# EAGLE design 20240511-sn76489-kempton-ver1 (EAGLE 9.6.2)
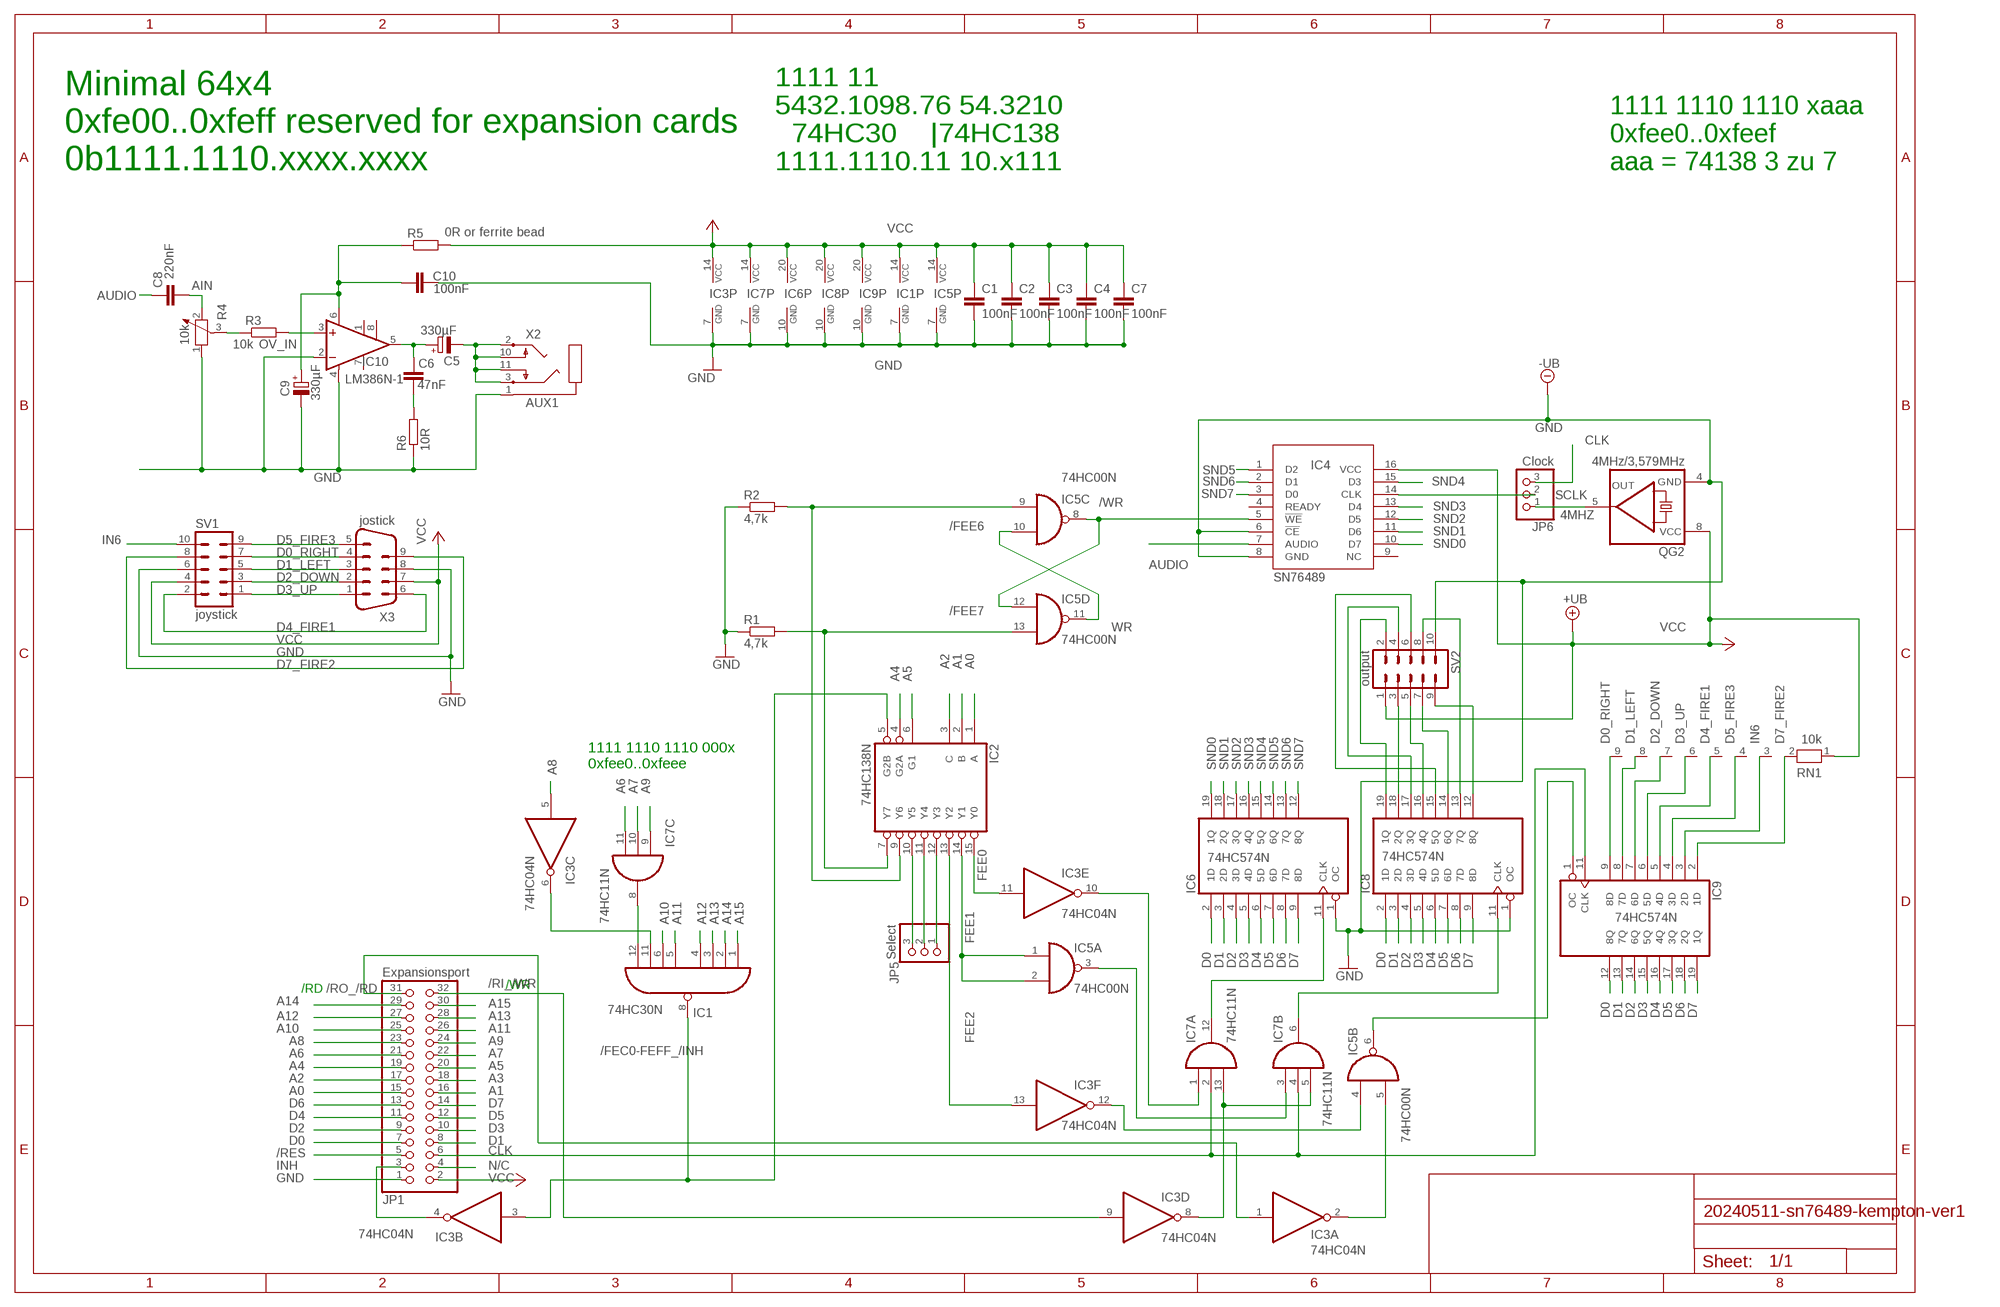
[diagram p0: schematic, sheet 1]

## Parts
C1  100nF  C-EU050-025X075  [C050-025X075]
C2  100nF  C-EU050-025X075  [C050-025X075]
C3  100nF  C-EU050-025X075  [C050-025X075]
C4  100nF  C-EU050-025X075  [C050-025X075]
C5  330µF  CPOL-EUE2.5-7  [E2,5-7]
C6  47nF  C-EU050-025X075  [C050-025X075]
C7  100nF  C-EU050-025X075  [C050-025X075]
C8  220nF  C-EU050-025X075  [C050-025X075]
C9  330µF  CPOL-EUE2.5-7  [E2,5-7]
C10  100nF  C-EU050-025X075  [C050-025X075]
IC1  74HC30N  [DIL14]
IC2  74HC138N  [DIL16]
IC3  74HC04N  [DIL14]
IC4  SN76489  ALEX-PARTS_SN76489AN  [ALEX-PARTS_DIL16]
IC5  74HC00N  [DIL14]
IC6  74HC574N  [DIL20]
IC7  74HC11N  [DIL14]
IC8  74HC574N  [DIL20]
IC9  74HC574N  [DIL20]
IC10  LM386N-1  [DIL08]
JP1  Expansionsport  PINHD-2X16  [2X16]
JP5  Select  PINHD-1X3  [1X03]
JP6  Clock  PINHD-1X3  [1X03]
QG2  4MHz/3,579MHz  QG5460  [DIL08S]
R1  4,7k  R-EU_0207/10  [0207/10]
R2  4,7k  R-EU_0207/10  [0207/10]
R3  10k  R-EU_0207/10  [0207/10]
R4  10k  POTENTIOMETER_PT-10S  [PT-10S]
R5  0R or ferrite bead  R-EU_0207/10  [0207/10]
R6  10R  R-EU_0207/10  [0207/10]
RN1  10k  RN08  [RN-9]
SV1  joystick  ML10  [ML10]
SV2  output  ML10  [ML10]
X2  AUX1  CON-SJ1-352XNSJ1-352XN  [SJ1-352XN]
X3  jostick  M09-182  [182-009-MALE]

## Nets
4MHZ: JP6.1 QG2.5(OUT)
/FEC0-FEFF_/INH: IC1.8(O) IC2.5(G2B) IC3.3(B:I)
/FEE6: IC2.9(Y6) IC5.9(C:I0) R2.2
/FEE7: IC2.7(Y7) IC5.13(D:I1) R1.2
/RES: JP1.5
/RI_/WR: IC3.9(D:I) JP1.32
/RO_/RD: IC3.1(A:I) JP1.31
/WR: IC4.5(!WE) IC5.8(C:O) IC5.12(D:I0)
A0: IC2.1(A) JP1.15
A1: IC2.2(B) JP1.16
A2: IC2.3(C) JP1.17
A3: JP1.18
A4: IC2.4(G2A) JP1.19
A5: IC2.6(G1) JP1.20
A6: IC7.11(C:I2) JP1.21
A7: IC7.10(C:I1) JP1.22
A8: IC3.5(C:I) JP1.23
A9: IC7.9(C:I0) JP1.24
A10: IC1.6(I5) JP1.25
A11: IC1.5(I4) JP1.26
A12: IC1.4(I3) JP1.27
A13: IC1.3(I2) JP1.28
A14: IC1.2(I1) JP1.29
A15: IC1.1(I0) JP1.30
AIN: C8.2 R4.2
AUDIO: C8.1 IC4.7(AUDIO)
AUXOUT1: C5.- X2.2 X2.3 X2.10 X2.11
AVCC [Power]: C9.+ C10.1 IC10.6(VS) R5.1
CLK: IC7.2(A:I1) IC7.4(B:I1) IC9.11(CLK) JP1.6 JP6.3
D0: IC6.2(1D) IC8.2(1D) IC9.12(8Q) JP1.7
D0_RIGHT: IC9.9(8D) RN1.9 SV1.7 X3.4
D1: IC6.3(2D) IC8.3(2D) IC9.13(7Q) JP1.8
D1_LEFT: IC9.8(7D) RN1.8 SV1.5 X3.3
D2: IC6.4(3D) IC8.4(3D) IC9.14(6Q) JP1.9
D2_DOWN: IC9.7(6D) RN1.7 SV1.3 X3.2
D3: IC6.5(4D) IC8.5(4D) IC9.15(5Q) JP1.10
D3_UP: IC9.6(5D) RN1.6 SV1.1 X3.1
D4: IC6.6(5D) IC8.6(5D) IC9.16(4Q) JP1.11
D4_FIRE1: IC9.5(4D) RN1.5 SV1.2 X3.6
D5: IC6.7(6D) IC8.7(6D) IC9.17(3Q) JP1.12
D5_FIRE3: IC9.4(3D) RN1.4 SV1.9 X3.5
D6: IC6.8(7D) IC8.8(7D) IC9.18(2Q) JP1.13
D7: IC6.9(8D) IC8.9(8D) IC9.19(1Q) JP1.14
D7_FIRE2: IC9.2(1D) RN1.2 SV1.8 X3.9
FEE0: IC2.15(Y0) IC3.11(E:I)
FEE1: IC2.14(Y1) IC5.1(A:I0) IC5.2(A:I1)
FEE2: IC3.12(F:O) IC5.4(B:I0)
FEE3: IC2.12(Y3) JP5.1
FEE4: IC2.11(Y4) JP5.2
FEE5: IC2.10(Y5) JP5.3
GND [Power]: C1.2 C2.2 C3.2 C4.2 C7.2 C9.- C10.2 IC1.7(GND) IC3.7(P:GND) IC4.6(!CE) IC4.8(GND) IC5.7(P:GND) IC6.1(OC) IC6.10(GND) IC7.7(P:GND) IC8.1(OC) IC8.10(GND) IC9.10(GND) IC10.2(-IN) IC10.4(GND) JP1.1 QG2.4(GND) R1.1 R2.1 R4.1 R6.1 SV1.6 SV2.10 X2.1 X3.8 ; supply symbol labelled -UB
IN6: IC9.3(2D) RN1.3 SV1.10
INH: IC3.4(B:O) JP1.3
INPUT_EN: IC5.6(B:O) IC9.1(OC)
N$1: IC3.2(A:O) IC5.5(B:I1)
N$2: IC3.10(E:O) IC7.1(A:I0)
N$3: IC1.12(I7) IC7.8(C:O)
N$4: IC5.3(A:O) IC7.3(B:I0)
N$5: IC2.13(Y2) IC3.13(F:I)
N$6: C6.2 R6.2
N$8: R3.1 R4.3
N$19: IC1.11(I6) IC3.6(C:O)
N/C: JP1.4
OUT0: IC8.19(1Q) SV2.2
OUT1: IC8.18(2Q) SV2.3
OUT2: IC8.17(3Q) SV2.4
OUT3: IC8.16(4Q) SV2.5
OUT4: IC8.15(5Q) SV2.6
OUT5: IC8.14(6Q) SV2.7
OUT6: IC8.13(7Q) SV2.8
OUT7: IC8.12(8Q) SV2.9
OUTPUT_EN: IC7.6(B:O) IC8.11(CLK)
OV_IN: IC10.3(+IN) R3.2
R2C2C3: C5.+ C6.1 IC10.5(OUT)
RI_WR: IC3.8(D:O) IC7.5(B:I2) IC7.13(A:I2)
SCLK: IC4.14(CLK) JP6.2
SND0: IC4.10(D7) IC6.19(1Q)
SND1: IC4.11(D6) IC6.18(2Q)
SND2: IC4.12(D5) IC6.17(3Q)
SND3: IC4.13(D4) IC6.16(4Q)
SND4: IC4.15(D3) IC6.15(5Q)
SND5: IC4.1(D2) IC6.14(6Q)
SND6: IC4.2(D1) IC6.13(7Q)
SND7: IC4.3(D0) IC6.12(8Q)
SOUND_EN: IC6.11(CLK) IC7.12(A:O)
VCC [Power]: C1.1 C2.1 C3.1 C4.1 C7.1 IC1.14(VCC) IC3.14(P:VCC) IC4.16(VCC) IC5.14(P:VCC) IC6.20(VCC) IC7.14(P:VCC) IC8.20(VCC) IC9.20(VCC) JP1.2 QG2.8(VCC) R5.2 RN1.1 SV1.4 SV2.1 X3.7 ; supply symbol labelled +UB
WR: IC5.10(C:I1) IC5.11(D:O)
Unconnected: IC4.4(READY) IC4.9(NC) IC10.1(GAIN) IC10.7(BYPASS) IC10.8(GAIN)

## Notes on the sheet
- Minimal 64x4
  0xfe00..0xfeff reserved for expansion cards
  0b1111.1110.xxxx.xxxx
- 1111 11
  5432.1098.76 54.3210
    74HC30    |74HC138
  1111.1110.11 10.x111
- 1111 1110 1110 xaaa
  0xfee0..0xfeef
  aaa = 74138 3 zu 7
- 1111 1110 1110 000x
  0xfee0..0xfeee
- /WR
- /RD

## Power pins joined to a net without a drawn wire
GND: IC2.8(GND)
VCC: IC2.16(VCC)

## Library data of the parts
C1-C4 C6-C8 C10 = rcl:C-EU: CAPACITOR, European symbol; SPICEPREFIX: C
C5 C9 = rcl:CPOL-EU: POLARIZED CAPACITOR, European symbol; SPICEPREFIX: C
IC1 = 74xx-eu:74*30: 8-input NAND gate
IC2 = 74xx-eu:74*138: 3-line to 8-line DECODER/DEMULTIPLEXER
IC3 = 74xx-eu:74*04: Hex INVERTER
IC4 = squareinator2:ALEX-PARTS_SN76489AN: TI SN76489AN Sound Generator
IC5 = 74xx-eu:74*00: Quad 2-input NAND gate
IC6 IC8 IC9 = 74xx-eu:74*574: 8-bit D type FLIP FLOP bus driver
IC7 = 74xx-eu:74*11: Triple 3-input AND gate
IC10 = linear:LM386?-*: Low Voltage Audio Power Amplifier Source: http://cache.national.com/ds/LM/LM386.pdf
JP1 = pinhead:PINHD-2X16: PIN HEADER
JP5 JP6 = pinhead:PINHD-1X3: PIN HEADER
QG2 = crystal:QG5460: CRYSTAL RESONATOR; OC_FARNELL: unknown; OC_NEWARK: unknown
R1-R3 R5 R6 = rcl:R-EU_: RESISTOR, European symbol; SPICEPREFIX: R
R4 = rcl:POTENTIOMETER_: Potentiometer; SPICEMODEL: POT; SPICEPREFIX: X
RN1 = resistor-net:RN08: RESISTOR NETWORK; OC_FARNELL: unknown; OC_NEWARK: unknown
SV1 SV2 = con-harting-ml:ML10: HARTING; OC_FARNELL: unknown; OC_NEWARK: unknown
X2 = con-sj1-352xn:CON-SJ1-352XN: MIC/HEADPHONE JACK KS-S stereo microphone/headphone jack SJ1-352XN (CUD Devices)
X3 = con-subd:M09: SUB-D; OC_FARNELL: unknown; OC_NEWARK: unknown

## Net classes
1 Power: width 0.305 mm, clearance 0.152 mm

## Board
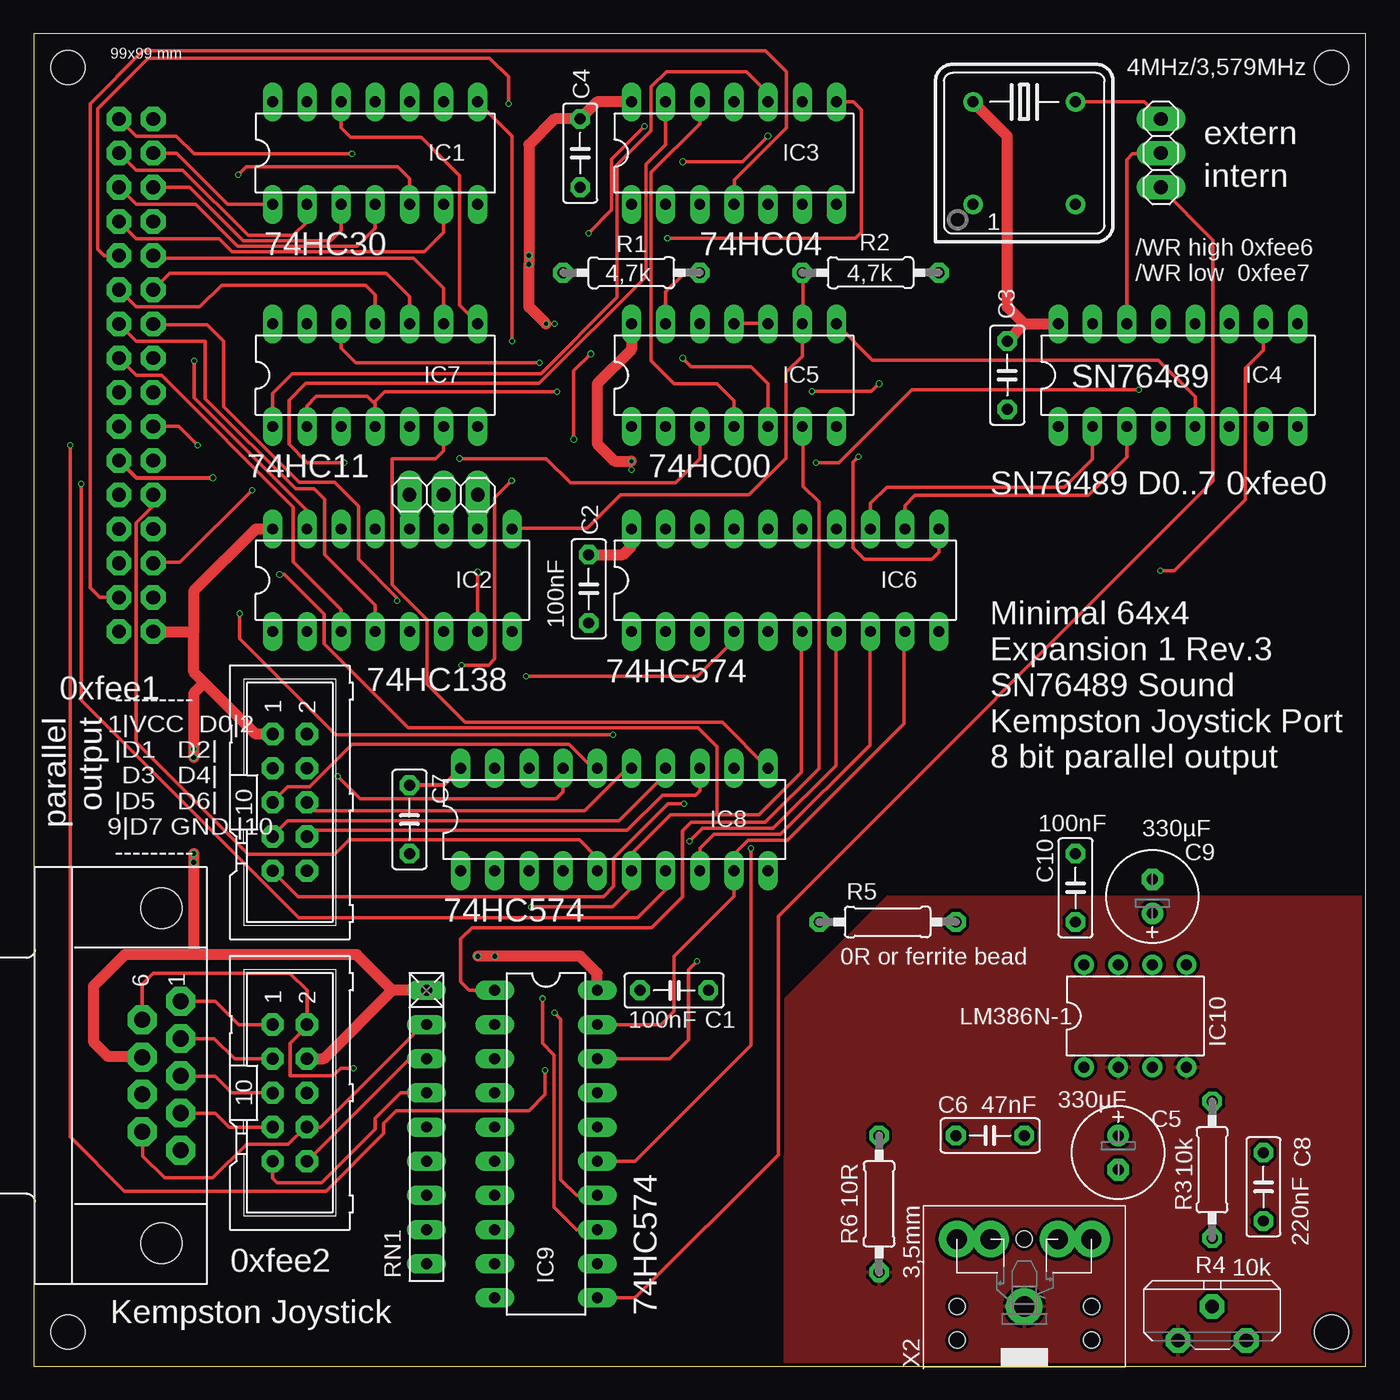
[diagram p1: board, top side]
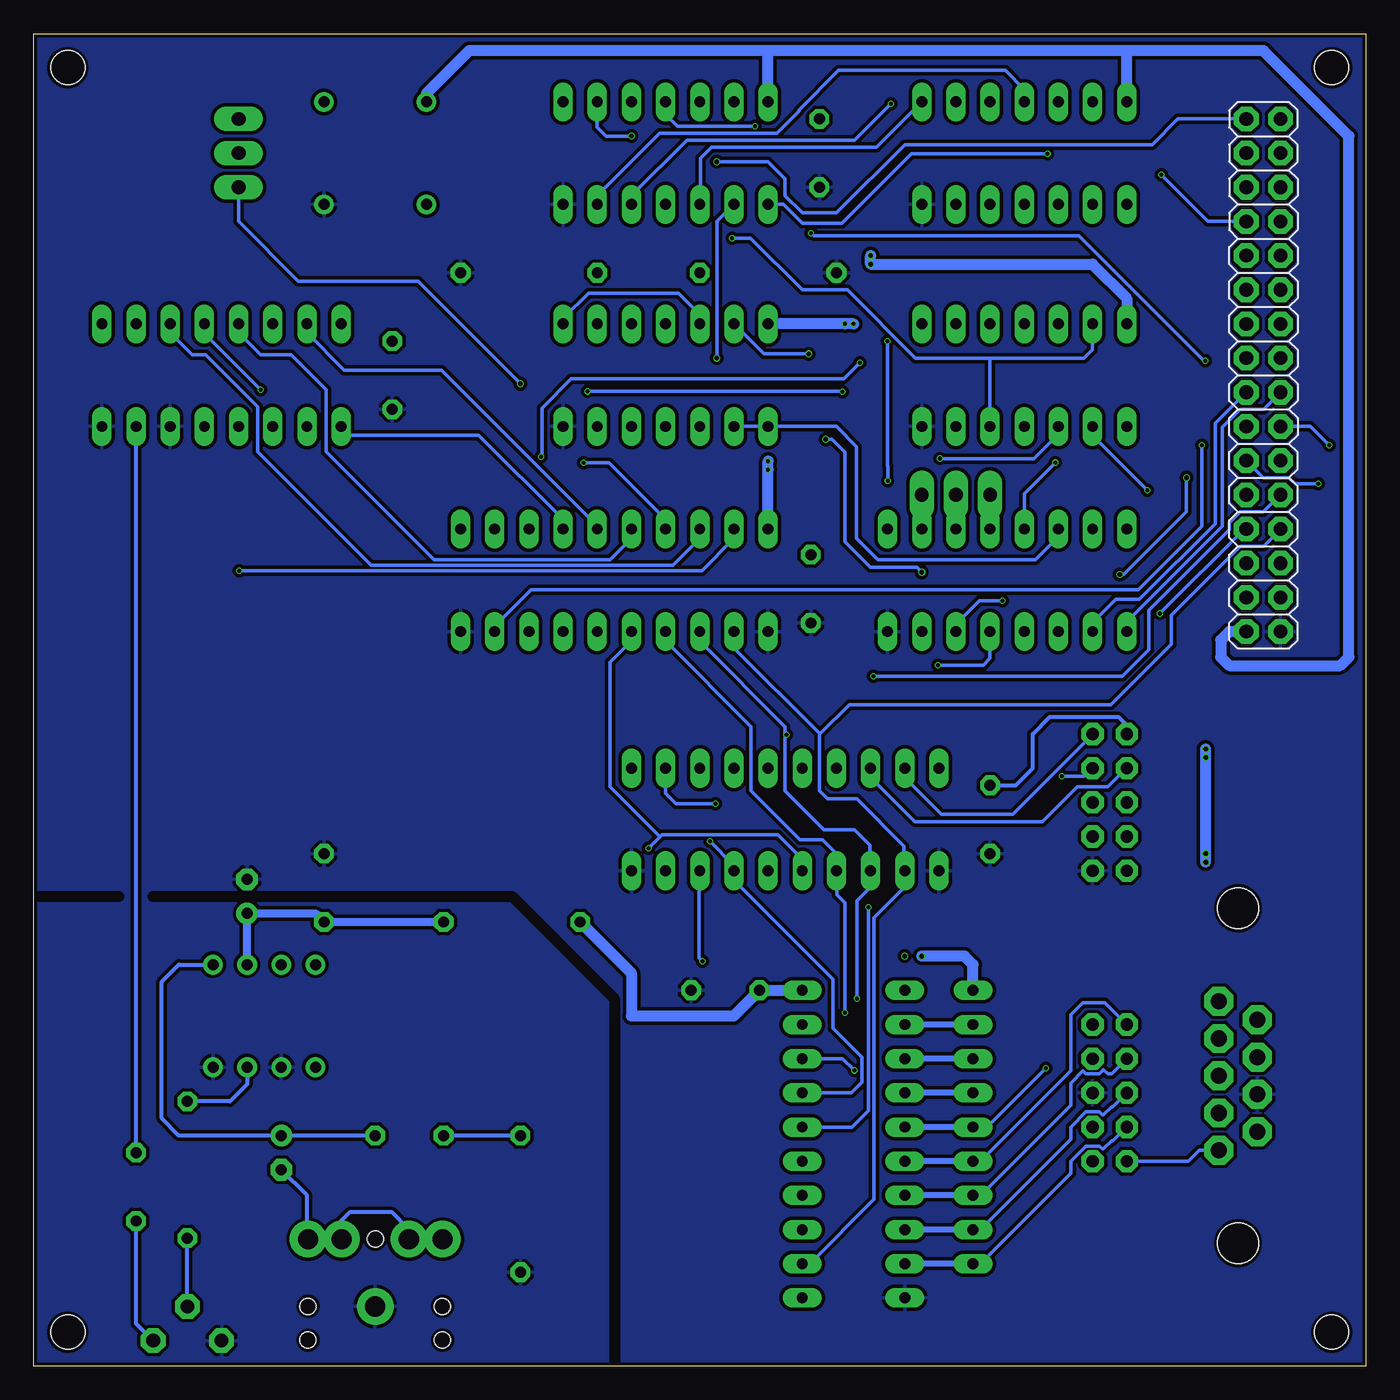
[diagram p2: board, bottom side, seen from below]

Size 99.06 x 99.05 mm. Coordinates in mm from the lower left corner, seen from the top.
Outline: 0,0 99.06,0 99.05,99.05 0,99.05 0,0
Copper layers (1*16): Top 0.035mm / dielectric 1.6mm / Bottom 0.035mm
Design rules "jlcpcb-2layers *": minimum track width 10mil, minimum drill 0.3mm, track to track 6mil, track to pad 6mil, pad to pad 6mil, via to via 6mil, smd to smd 6mil, copper to edge 0.2mm, drill to drill 6mil, minimum pad ring 10mil, minimum via ring 3mil, stop-mask expansion 4mil, vias tented up to drill 0mil, thermal gap 10mil
Holes 2.54 mm at 2.54,2.54 96.52,2.54 96.52,96.52 2.54,96.52
bRestrict: 4 lines

### Footprints (pad centres in the part's own frame; a part is rotated, then mirrored left to right if it is on the bottom)
C050-025X075 = drill 0.813 octagon: 1 -2.54,0; 2 2.54,0
E2,5-7 = drill 0.813 pad 1.6: + -1.27,0 | drill 0.813 pad 1.6 octagon: - 1.27,0
DIL14 = drill 0.813 long: 1 -7.62,-3.81; 2 -5.08,-3.81; 3 -2.54,-3.81; 4 0,-3.81; 5 2.54,-3.81; 6 5.08,-3.81; 7 7.62,-3.81; 8 7.62,3.81; 9 5.08,3.81; 10 2.54,3.81; 11 0,3.81; 12 -2.54,3.81; 13 -5.08,3.81; 14 -7.62,3.81
DIL16 = drill 0.813 long: 1 -8.89,-3.81; 2 -6.35,-3.81; 3 -3.81,-3.81; 4 -1.27,-3.81; 5 1.27,-3.81; 6 3.81,-3.81; 7 6.35,-3.81; 8 8.89,-3.81; 9 8.89,3.81; 10 6.35,3.81; 11 3.81,3.81; 12 1.27,3.81; 13 -1.27,3.81; 14 -3.81,3.81; 15 -6.35,3.81; 16 -8.89,3.81
ALEX-PARTS_DIL16 = drill 0.813 long: 1 -8.89,-3.81; 2 -6.35,-3.81; 3 -3.81,-3.81; 4 -1.27,-3.81; 5 1.27,-3.81; 6 3.81,-3.81; 7 6.35,-3.81; 8 8.89,-3.81; 9 8.89,3.81; 10 6.35,3.81; 11 3.81,3.81; 12 1.27,3.81; 13 -1.27,3.81; 14 -3.81,3.81; 15 -6.35,3.81; 16 -8.89,3.81
DIL20 = drill 0.813 long: 1 -11.43,-3.81; 2 -8.89,-3.81; 3 -6.35,-3.81; 4 -3.81,-3.81; 5 -1.27,-3.81; 6 1.27,-3.81; 7 3.81,-3.81; 8 6.35,-3.81; 9 8.89,-3.81; 10 11.43,-3.81; 11 11.43,3.81; 12 8.89,3.81; 13 6.35,3.81; 14 3.81,3.81; 15 1.27,3.81; 16 -1.27,3.81; 17 -3.81,3.81; 18 -6.35,3.81; 19 -8.89,3.81; 20 -11.43,3.81
DIL08 = drill 0.813 pad 1.27: 1 -3.81,-3.81; 2 -1.27,-3.81; 3 1.27,-3.81; 4 3.81,-3.81; 5 3.81,3.81; 6 1.27,3.81; 7 -1.27,3.81; 8 -3.81,3.81
2X16 = drill 1.016 octagon: 1 -19.05,-1.27; 2 -19.05,1.27; 3 -16.51,-1.27; 4 -16.51,1.27; 5 -13.97,-1.27; 6 -13.97,1.27; 7 -11.43,-1.27; 8 -11.43,1.27; 9 -8.89,-1.27; 10 -8.89,1.27; 11 -6.35,-1.27; 12 -6.35,1.27; 13 -3.81,-1.27; 14 -3.81,1.27; 15 -1.27,-1.27; 16 -1.27,1.27; 17 1.27,-1.27; 18 1.27,1.27; 19 3.81,-1.27; 20 3.81,1.27; 21 6.35,-1.27; 22 6.35,1.27; 23 8.89,-1.27; 24 8.89,1.27; 25 11.43,-1.27; 26 11.43,1.27; 27 13.97,-1.27; 28 13.97,1.27; 29 16.51,-1.27; 30 16.51,1.27; 31 19.05,-1.27; 32 19.05,1.27
1X03 = drill 1.016 long: 1 -2.54,0; 2 0,0; 3 2.54,0
DIL08S = drill 0.813: 1 -3.81,-3.81; 4 3.81,-3.81; 5 3.81,3.81; 8 -3.81,3.81
0207/10 = drill 0.813 octagon: 1 -5.08,0; 2 5.08,0
PT-10S = drill 1.016 pad 1.778 octagon: 1 -2.54,-1.27; 2 2.54,-1.27; 3 0,1.27
RN-9 = drill 0.813 long: 1 -10.16,0; 2 -7.62,0; 3 -5.08,0; 4 -2.54,0; 5 0,0; 6 2.54,0; 7 5.08,0; 8 7.62,0; 9 10.16,0
ML10 = drill 0.914 octagon: 1 -5.08,-1.27; 2 -5.08,1.27; 3 -2.54,-1.27; 4 -2.54,1.27; 5 0,-1.27; 6 0,1.27; 7 2.54,-1.27; 8 2.54,1.27; 9 5.08,-1.27; 10 5.08,1.27
SJ1-352XN = drill 1.5 pad 2.184: 1 0,0; 2 5,-5; 3 5,5; 10 5,-2.5; 11 5,2.5 | hole 1.2: 5,0; 0,5; 0,-5; -2.5,-5; -2.5,5
182-009-MALE = drill 1.194 pad 1.524 octagon: 1 -5.537,10.923; 2 -2.769,10.923; 3 0,10.923; 4 2.769,10.923; 5 5.537,10.923; 6 -4.153,8.08; 7 -1.384,8.08; 8 1.384,8.08; 9 4.153,8.08 | hole 3.048: -12.446,9.501; 12.446,9.501

### Placement (x,y rotation side)
C1  47.62,27.94 0 top
C2  41.27,57.78 270 top
C3  72.39,73.66 270 top
C4  40.64,90.17 270 top
C5  80.64,15.88 270 top
C6  71.12,17.14 180 top
C7  27.94,40.64 270 top
C8  91.44,13.34 270 top
C9  83.19,34.92 90 top
C10  77.47,35.56 90 top
IC1  25.4,90.17 0 top
IC2  26.67,58.42 0 top
IC3  52.07,90.17 0 top
IC4  85.09,73.66 0 top
IC5  52.07,73.66 0 top
IC6  55.88,58.42 0 top
IC7  25.4,73.66 0 top
IC8  43.18,40.64 0 top
IC9  38.1,16.51 270 top
IC10  81.92,26.04 0 top
JP1  7.62,73.66 90 bottom
JP5  30.48,64.77 0 top
JP6  83.82,90.17 270 top
QG2  73.66,90.17 0 top
R1  44.45,81.28 0 top
R2  62.23,81.28 180 top
R3  87.63,14.61 90 top
R4  87.63,3.17 0 top
R5  63.5,33.02 180 top
R6  62.87,12.06 90 top
RN1  29.21,17.78 270 top
SV1  19.05,20.32 270 top
SV2  19.05,41.91 270 top
X2  73.66,4.45 90 top
X3  0,21.59 270 top

### Tracks (layer width: path | path; a pad name or v marks a point on that pad's centre or on a via)
4MHZ
  Top 0.254: QG2.5 82.6,93.98 83.82,92.76 JP6.1
/FEC0-FEFF_/INH  (via drill 0.3)
  Top 0.254: v31.83,52.11 33.81,52.11 34.28,52.58 34.28,64.54 v35.55,65.81 | v35.56,76.2 35.56,91.44 IC1.8
  Bottom 0.254: IC2.5 27.94,52.62 28.45,52.11 v31.83,52.11 | v35.55,65.81 35.55,66.92 35.56,66.93 v35.56,76.2 | IC1.8 36.39,90.61 48.64,90.61 49.48,89.77 49.48,86.36 IC3.3
/FEE6
  Top 0.254: IC2.9 35.56,62.28 41.15,62.28 43.64,64.77 53.19,64.77 55.92,67.5 55.92,73.86 57.15,75.09 IC5.9 57.2,77.52 57.2,81.28 R2.2
/FEE7  (via drill 0.35)
  Top 0.254: IC5.13 46.99,79.85 48.42,81.28 R1.2 | v33.02,59.02 IC2.7 | v41.43,75.25 40.16,73.98 v40.16,68.9
  Bottom 0.254: v33.02,59.02 33.38,59.37 36.83,59.37 38.73,61.28 38.73,67.94 39.69,68.9 v40.16,68.9 | v41.43,75.25 44.77,75.25 IC5.13
/RI_/WR  (via drill 0.35)
  Top 0.254: v54.61,91.44 52.7,89.53 v48.26,89.53
  Bottom 0.254: JP1.32 13.97,92.71 15.88,90.81 34.29,90.81 39.37,85.72 41.91,85.72 43.18,87 43.18,88.27 44.45,89.53 v48.26,89.53 | v54.61,91.44 56.52,91.44 57.15,92.08 IC3.9
/RO_/RD  (via drill 0.3)
  Top 0.254: v23.67,90.13 11.93,90.13 10.62,91.44 7.62,91.44 JP1.31
  Bottom 0.254: IC3.1 43.3,86.36 41.88,84.94 38.97,84.94 33.79,90.13 v23.67,90.13
/WR
  Top 0.254: IC4.5 86.36,72.05 83.63,74.79 62.37,74.79 IC5.8
  Bottom 0.254: IC5.12 49.58,77.52 49.58,78.23 51.1,79.76 57.81,79.76 59.64,77.93 59.64,77.52 IC5.8
A0
  Bottom 0.254: IC2.1 17.78,55.33 10.67,62.44 10.67,69.8 9.35,71.12 7.64,71.12 7.62,71.14 7.6,71.14 JP1.15
A1
  Bottom 0.254: IC2.2 20.32,55.24 18.57,56.99 16.83,56.99 11.19,62.63 11.19,70.09 JP1.16
A2
  Top 0.254: IC2.3 22.86,56.24 19.3,59.79 19.3,63.86 9.51,73.66 7.62,73.66 JP1.17
A4
  Top 0.254: IC2.4 25.4,56.55 21.65,60.3 21.65,64.43 20.88,65.21 19.47,65.21 12.76,71.91 12.76,76.2 7.62,76.2 JP1.19
A5  (via drill 0.3)
  Top 0.254: v27.03,56.9 27.03,57.1 24.15,59.97 24.15,63.91 22.38,65.69 19.75,65.69 14.12,71.32 14.12,76.2 12.9,77.42 8.94,77.42 JP1.20
  Bottom 0.254: IC2.6 30.48,55.17 28.75,56.9 v27.03,56.9
A6
  Top 0.254: IC7.11 25.4,79.65 24.7,80.36 13.98,80.36 12.36,78.74 7.62,78.74 JP1.21
A7
  Top 0.254: IC7.10 27.94,79.5 26.21,81.23 10.11,81.23 JP1.22
A8  (via drill 0.3)
  Top 0.254: v35.31,93.85 35.31,95.83 33.9,97.24 8.52,97.24 4.76,93.48 4.76,83.03 5.24,82.55 JP1.23
  Bottom 0.254: v35.31,93.85 38.02,91.14 50.49,91.14 54.56,87.07 54.56,86.36 IC3.5
A9
  Top 0.254: IC7.9 30.48,80.13 28.27,82.34 9.1,82.34 JP1.24
A10
  Top 0.254: IC1.6 30.48,84.28 29.03,82.84 14.78,82.84 13.79,83.82 7.62,83.82 JP1.25
A11  (via drill 0.3)
  Top 0.254: IC1.5 27.94,88.28 27.08,89.14 15.8,89.14 v15.22,88.56
  Bottom 0.254: JP1.26 11.75,85.09 v15.22,88.56
A12
  Top 0.254: IC1.4 25.4,84.6 24.04,83.24 15.16,83.24 12.05,86.36 7.62,86.36 JP1.27
A13
  Top 0.254: IC1.3 22.86,84.44 22.07,83.65 15.57,83.65 11.59,87.63 JP1.28
A14
  Top 0.254: IC1.2 20.32,85.08 19.3,84.06 15.94,84.06 11.09,88.9 7.62,88.9 JP1.29
A15
  Top 0.254: IC1.1 14.45,86.36 10.64,90.17 JP1.30
AIN
  Bottom 0.305: R4.2 91.44,3.17 C8.2
AUDIO
  Bottom 0.305: C8.1 IC4.7
AUXOUT1
  Bottom 0.305: X2.3 X2.11 71.16,10.2 72.39,11.43 75.56,11.43 76.2,10.79 76.2,9.48 X2.10 X2.2 78.74,9.53 78.74,12.7 C5.-
AVCC
  Bottom 0.61: IC10.6 C9.+ 78.11,33.66 C10.1 R5.1
CLK  (via drill 0.3, 0.35)
  Top 0.254: IC7.2 20.32,71.4 21.02,72.1 24.78,72.1 25.4,71.49 IC7.4 25.4,71.72 26.11,72.42 v38.93,72.42 | v16.26,65.13 10.87,59.74 8.94,59.74 JP1.6 | IC9.11 44.73,5.08 55.37,15.72 55.37,33.45 87.69,65.77 87.69,83.71 83.82,87.58 JP6.3 | v57.86,72.45 62.29,72.45 v62.87,73.03
  Bottom 0.254: v16.26,65.13 20.32,69.19 IC7.2 | v38.93,72.42 38.96,72.45 v57.86,72.45 | JP6.3 83.82,85.09 79.38,80.64 70.48,80.64 v62.87,73.03
D0
  Bottom 0.254: 40.64,47.04 40.64,42.77 40.03,42.16 37.84,42.16 34.34,38.66 34.34,36.88 IC8.2 34.34,36.78 34.34,35.56 36.58,33.33 36.58,12.39 41.35,7.62 IC9.12 | 40.64,47.04 46.94,53.34 46.94,54.56 IC6.2 | JP1.7 6.35,62.19 7.59,60.95 7.6,60.96 9.35,60.96 14.48,55.83 14.48,53.67 18.97,49.17 38.41,49.17 40.54,47.04 40.64,47.04
D0_RIGHT
  Top 0.254: SV1.7 14.53,17.78 13.49,18.82 X3.4
  Bottom 0.254: SV1.7 18.8,16.76 18.9,16.76 19.51,16.15 19.61,16.15 19.81,16.36 20.83,16.36 21.95,15.24 21.95,14.33 28.55,7.72 29.06,7.72 RN1.9
  Bottom 0.457: RN1.9 IC9.9
D1  (via drill 0.3)
  Top 0.254: IC9.13 40.36,10.16 38.71,11.81 38.71,23.12 37.83,24 v37.83,27.33 | v15.33,55.95 15.33,54.08 22.47,46.94 v43.08,46.94
  Bottom 0.254: v37.83,27.33 37.83,34.61 36.88,35.56 36.88,36.78 IC8.3 36.88,36.88 36.88,38.72 38.03,39.87 40.28,39.87 43.18,42.77 43.18,46.94 | 43.18,46.94 43.18,47.55 49.48,53.85 49.48,54.56 IC6.3 | v15.33,55.95 9.05,62.23 JP1.8 | v43.08,46.94 43.18,46.94
D1_LEFT
  Top 0.254: SV1.5 14.73,20.32 13.51,21.54 10.97,21.54 X3.3
  Bottom 0.254: SV1.5 18.8,19.3 18.9,19.3 19.51,18.69 19.61,18.69 19.81,18.9 20.83,18.9 21.95,17.78 21.95,16.87 28.55,10.26 29.06,10.26 RN1.8
  Bottom 0.457: RN1.8 IC9.8
D2  (via drill 0.3)
  Top 0.254: IC9.14 40.36,12.7 39.19,13.87 39.19,25.79 v38.72,26.26 | v36.63,51.28 49.38,51.28 52.07,53.98 IC6.4
  Bottom 0.254: v38.72,26.26 38.72,34.45 39.32,35.05 39.32,36.78 IC8.4 39.3,36.9 39.3,38 40.42,39.12 42.06,39.12 45.72,42.77 45.72,47.55 52.02,53.85 52.02,54.56 IC6.4 | JP1.9 7.62,63.5 9.35,63.5 10.16,62.69 10.16,62.18 16.15,56.19 16.15,53.24 18.11,51.28 v36.63,51.28
D2_DOWN
  Top 0.254: SV1.3 14.94,22.86 13.44,24.36 X3.2
  Bottom 0.254: SV1.3 18.9,21.74 19.2,21.74 19.51,22.05 19.81,21.74 20.83,21.74 21.03,21.95 21.95,21.03 21.95,19.41 28.55,12.8 29.06,12.8 RN1.7
  Bottom 0.457: RN1.7 IC9.7
D3  (via drill 0.3)
  Top 0.254: IC9.15 44.73,15.24 53.34,23.85 v53.34,38.51 | IC8.5 41.91,37.78 40.58,39.12 23.46,39.12 22.39,38.04 15.95,38.04 7.62,46.37 7.62,62.69 8.84,63.91 8.84,64.72 JP1.10
  Bottom 0.254: 52.48,39.37 52.32,39.52 43.72,39.52 41.96,37.76 41.96,36.88 IC8.5 | 52.48,39.37 v53.34,38.51 | 52.48,39.37 56.19,43.08 56.19,52.32 54.66,53.85 54.66,54.56 IC6.5
D3_UP
  Top 0.254: SV1.1 15.24,25.4 13.51,27.13 X3.1
  Bottom 0.254: SV1.1 19.41,27.03 21.03,27.03 21.95,26.11 21.95,21.95 28.55,15.34 29.06,15.34 RN1.6
  Bottom 0.457: RN1.6 IC9.6
D4  (via drill 0.3, 0.35)
  Top 0.254: 50.8,41 47.35,41 44.45,38.1 IC8.6 44.45,35.56 43.05,34.16 37.04,34.16 v37,34.12 | 50.8,41 53.95,41 57.1,44.15 57.1,54.56 IC6.6 | 50.8,41 50.8,46.05 49.4,47.45 27.84,47.45 21.59,53.7 21.59,55.88 18.61,58.86 v18.3,58.86
  Top 0.305: JP1.11 7.62,66.04 v13.34,66.04
  Bottom 0.254: IC9.16 38.2,17.78 37,18.98 v37,34.12 | v18.3,58.86 17.98,58.86 13.34,63.5 v13.34,66.04
D4_FIRE1  (via drill 0.3)
  Top 0.254: v23.79,22.16 22.84,22.16 22.26,21.58 19.06,21.58 19.06,24.02 20.32,25.28 SV1.2 20.32,27.94 19.05,29.21 8.89,29.21 8.08,28.4 X3.6
  Bottom 0.254: v23.79,22.16 28.07,17.88 29.06,17.88 RN1.5
  Bottom 0.457: RN1.5 IC9.5
D5  (via drill 0.3)
  Top 0.254: v48.77,39.01 49.74,39.99 54.99,39.99 59.64,44.64 59.64,54.56 IC6.7 | v3.53,65.58 3.53,49.51 19.7,33.33 44.92,33.33 46.99,35.4 IC8.7
  Bottom 0.254: IC9.17 38.26,20.32 37.45,21.12 37.45,22.95 39.62,25.12 39.62,28.75 46.94,36.07 46.94,36.78 IC8.7 47.04,36.88 47.04,37.29 v48.77,39.01 | v3.53,65.58 5.26,65.58 5.71,66.04 7.62,66.04 JP1.12
D5_FIRE3
  Top 0.254: SV1.9 17.78,13.97 18.1,13.65 21.43,13.65 25.4,17.62 25.4,18.41 27.3,20.32 RN1.4
  Bottom 0.254: SV1.9 13.21,15.24 12.39,16.05 X3.5
  Bottom 0.457: RN1.4 IC9.4
D6  (via drill 0.3)
  Top 0.254: IC9.18 47.27,22.86 48.69,24.28 48.69,29.46 v49.33,30.1 | IC8.8 49.53,38.5 50.57,39.54 55.55,39.54 62.18,46.17 62.18,54.56 IC6.8 | v2.74,68.46 2.71,68.43 2.71,17.06 6.75,13.01 21.74,13.01 26.04,17.3 26.04,18.06 26.96,18.99 36.83,18.99 38.04,20.2 v38.04,21.98
  Bottom 0.254: v49.33,30.1 49.58,30.35 49.58,36.78 IC8.8 | v2.74,68.46 4.13,69.85 JP1.13 | v38.04,21.98 38.92,22.86 IC9.18
D7  (via drill 0.3)
  Top 0.254: IC9.19 46.63,25.4 47.62,26.39 47.62,30.48 52.07,34.92 IC8.9 52.12,36.88 52.12,38.1 53.12,39.09 56.07,39.09 64.72,47.74 64.72,54.56 IC6.9 | v12.19,68.45 10.79,69.85 JP1.14
  Bottom 0.254: v12.19,68.45 12.19,62.44 16.91,57.72 62.06,57.72 64.72,55.07 64.72,54.66 IC6.9
D7_FIRE2
  Top 0.254: RN1.2 28.96,25.4 21.34,17.78 SV1.8 20.22,17.78 18.94,16.5 15.83,16.5 13.32,13.99 9.73,13.99 8.13,15.6 8.13,17.37 X3.9
  Bottom 0.457: RN1.2 IC9.2
FEE0  (via drill 0.3)
  Top 0.254: IC2.15 20.32,63.59 11.94,71.97 v11.94,74.74 | v41.25,84.23 42.98,85.95 42.98,89.71 v45.41,92.15
  Bottom 0.254: v11.94,74.74 12.05,74.74 21.34,84.02 41.05,84.02 v41.25,84.23 | IC3.11 52.07,93.03 51.19,92.15 v45.41,92.15
FEE1
  Bottom 0.254: IC2.14 22.86,61.67 24.59,59.94 36.27,59.94 37.87,61.54 37.87,68.35 39.37,69.85 IC5.1 IC5.2
FEE2
  Top 0.254: IC5.4 52.07,71.75 50.8,73.03 47.62,73.03 45.92,74.73 45.92,88.75 49.53,92.35 IC3.12
FEE3
  Top 0.254: JP5.1 IC2.12
FEE4
  Top 0.254: JP5.2 IC2.11
FEE5
  Top 0.254: JP5.3 IC2.10
GND
  pour Bottom (isolate 0.254): 0,99.06 0,0 99.06,0 99.06,99.06
  pour Top (isolate 0.254): 99.06,0 55.88,0 55.88,27.3 59.69,31.11 63.5,34.92 91.44,34.92 99.06,34.92
IN6
  Top 0.254: SV1.10 27.94,22.86 RN1.3
  Bottom 0.457: RN1.3 IC9.3
INH
  Top 0.254: JP1.3 4.92,57.15 4.2,57.87 4.2,93.85 8.13,97.78 54.43,97.78 55.99,96.21 55.99,92.07 52.12,88.19 52.12,86.36 IC3.4
INPUT_EN
  Top 0.254: IC9.1 32.38,27.94 31.75,28.57 31.75,31.76 32.59,32.61 45.95,32.61 48.26,34.91 48.26,39.8 48.9,40.43 54.39,40.43 58.38,44.42 58.38,64.25 57.2,65.42 57.2,69.8 IC5.6
N$1  (via drill 0.35)
  Top 0.254: v48.26,74.93 48.9,74.3 53.34,74.3 54.61,73.03 IC5.5
  Bottom 0.254: IC3.2 48.26,85.09 v48.26,74.93
N$2
  Top 0.254: IC7.1 17.78,72.33 19.23,73.78 37.71,73.78 43.38,79.45 43.38,89.31 45.92,91.85 45.92,95.1 47.04,96.22 53.01,96.22 54.61,94.61 IC3.10
N$3
  Top 0.254: IC1.12 22.86,92.06 23.56,91.36 28.82,91.36 31.69,88.5 31.69,78.85 33.02,77.52 IC7.8
N$4  (via drill 0.3)
  Top 0.254: v31.66,67.47 38.12,67.47 39.94,65.65 47.71,65.65 49.53,67.47 IC5.3
  Bottom 0.254: IC7.3 22.86,69.29 24.69,67.46 v31.65,67.46 v31.66,67.47
N$5  (via drill 0.3)
  Top 0.254: v23.08,67.17 20.34,67.17 18.99,68.52 18.99,71.81 20.23,73.06 37.6,73.06 45.52,80.97 45.52,89.33 46.99,90.81 IC3.13
  Bottom 0.254: IC2.13 25.4,64.85 v23.08,67.17
N$6
  Bottom 0.305: R6.2 C6.2
N$8
  Bottom 0.305: R4.3 R3.1
N$19
  Bottom 0.254: IC1.11 25.4,94.89 26.82,96.32 39.22,96.32 42.16,93.37 42.16,93.27 43.79,91.64 52.53,91.64 57.1,87.07 57.1,86.36 IC3.6
OUT0
  Bottom 0.254: IC8.19 34.24,44.4 34.24,43.69 31.57,41.02 26.24,41.02 20.32,46.94 SV2.2
OUT1
  Bottom 0.254: IC8.18 36.78,44.4 36.78,43.69 33.55,40.46 24.06,40.46 21.44,43.08 19.2,43.08 17.78,44.5 SV2.3
OUT2  (via drill 0.3)
  Top 0.254: IC8.17 39.37,42.7 38.83,42.16 24.29,42.16 v22.59,43.86
  Bottom 0.254: v22.59,43.86 20.96,43.86 20.32,44.5 SV2.4
OUT3
  Top 0.254: IC8.16 41.86,44.5 41.55,44.5 39.83,46.23 23.67,46.23 20.52,43.08 18.9,43.08 17.78,41.96 SV2.5
OUT4
  Top 0.254: IC8.15 44.4,44.4 44.09,44.4 40.98,41.28 20.9,41.28 20.32,41.86 SV2.6
OUT5
  Top 0.254: IC8.14 46.99,44.01 43.52,40.54 18.9,40.54 17.78,39.42 SV2.7
OUT6
  Top 0.254: IC8.13 49.53,42.78 49.2,42.45 46.75,42.45 44.14,39.84 20.74,39.84 20.32,39.42 SV2.8
OUT7  (via drill 0.3)
  Top 0.254: v48.35,41.8 47.19,41.8 43.14,37.75 43.14,35.66 42.37,34.89 19.67,34.89 17.78,36.78 SV2.9
  Bottom 0.254: IC8.12 52.07,42.59 51.29,41.8 v48.35,41.8
OUTPUT_EN
  Top 0.254: IC7.6 30.48,68.06 29.88,67.46 26.65,67.46 26.65,58.09 29.26,55.47 29.26,50.69 32.1,47.85 51.21,47.85 IC8.11
OV_IN
  Bottom 0.305: IC10.3 83.19,20.95 84.45,19.68 R3.2
R2C2C3
  Bottom 0.305: IC10.5 88.27,29.84 89.53,28.57 89.53,18.41 88.27,17.14 C5.+ C6.1
RI_WR  (via drill 0.3)
  Top 0.254: IC3.8 60.96,93.98 61.54,93.4 61.54,84.28 61.11,83.85 v47.12,83.85
  Bottom 0.254: v47.12,83.85 45.75,83.85 41.91,80.01 38.56,80.01 33.48,74.93 27.94,74.93 | IC7.13 20.32,75.56 20.95,74.93 27.94,74.93 | IC7.5 27.94,74.93
SCLK
  Top 0.254: IC4.14 81.28,89.69 81.71,90.12 83.82,90.12 JP6.2
SND0  (via drill 0.3)
  Top 0.254: v83.77,59.13 84.84,59.13 90.11,64.4 90.11,74.18 91.44,75.51 IC4.10
  Bottom 0.254: v83.77,59.13 49.38,59.13 47.04,61.47 47.04,62.18 IC6.19
SND1
  Bottom 0.254: IC4.11 88.9,76.81 87.27,75.18 86.26,75.18 82.4,71.32 82.4,67.97 73.97,59.54 51.51,59.54 49.58,61.47 49.58,62.18 IC6.18
SND2  (via drill 0.3)
  Top 0.254: v58.19,67.16 59.87,67.16 65.3,72.59 v82.18,72.59
  Bottom 0.254: v58.19,67.16 56.29,67.16 52.12,62.99 52.12,62.28 IC6.17 | v82.18,72.59 86.36,76.77 IC4.12
SND3
  Bottom 0.254: IC4.13 83.82,76.81 82.19,75.18 79.91,75.18 77.32,72.59 77.32,67.97 69.29,59.94 56.19,59.94 54.66,61.47 54.66,62.18 IC6.16
SND4
  Bottom 0.254: IC4.15 78.74,76.81 75.97,74.04 68.73,74.04 57.2,62.52 57.2,62.28 IC6.15
SND5
  Bottom 0.254: IC6.14 59.74,62.28 59.74,62.99 65.96,69.22 75.56,69.22 IC4.1
SND6
  Top 0.254: IC6.13 62.23,64.14 63.44,65.34 76.65,65.34 78.74,67.43 IC4.2
SND7
  Top 0.254: IC6.12 64.77,63.98 65.53,64.74 78.44,64.74 81.28,67.58 IC4.3
SOUND_EN  (via drill 0.3)
  Top 0.254: IC6.11 67.31,60.48 66.8,59.98 61.77,59.98 60.92,60.83 60.92,67.2 v61.32,67.6 | v37.62,74.58 23.95,74.58 22.86,75.67 IC7.12
  Bottom 0.254: v61.32,67.6 61.27,67.65 61.27,71.22 59.09,73.4 38.81,73.4 v37.62,74.58
VCC  (via drill 0.3, 0.35)
  Top 0.305: C7.1 30.48,43.18 IC8.20
  Top 0.813: IC3.14 41.91,93.98 C4.1 | C4.1 38.73,92.71 36.83,90.81 v36.83,81.92 36.83,78.74 v38.09,77.47 | SV2.1 16.51,46.99 12.7,50.8 | 12.7,50.8 11.91,51.59 11.91,54.61 | JP1.2 11.91,54.61 | IC2.16 16.51,62.23 11.91,57.63 11.91,54.61 | 12.7,50.8 11.91,50.01 v11.91,45.24 | v11.91,38.1 11.91,30.59 | IC9.20 41.91,29.21 40.64,30.48 v34.29,30.48 v33.02,30.48 | SV1.4 21.59,22.86 26.67,27.94 | RN1.1 26.67,27.94 | 11.91,30.59 24.02,30.59 26.67,27.94 | 11.91,30.59 6.78,30.59 4.45,28.26 4.45,24.13 5.56,23.02 8.04,23.02 X3.7 | C3.1 73.66,77.47 | 73.66,77.47 IC4.16 | QG2.8 72.39,91.44 72.39,78.74 73.66,77.47 | IC5.14 44.45,75.56 41.91,73.03 41.91,68.58 43.21,67.28 v44.45,67.28 | IC6.20 44.45,60.96 43.81,60.33 C2.1 | C4.1 40.64,92.66
  Bottom 0.305: C7.1 26.04,43.18 24.77,44.45 24.77,46.99 23.5,48.26 18.41,48.26 17.78,47.62 SV2.1
  Bottom 0.813: JP1.2 10.16,54.61 10.79,53.98 10.79,52.7 10.16,52.07 1.91,52.07 1.27,52.7 1.27,91.44 7.62,97.79 17.78,97.79 | 17.78,97.79 44.45,97.79 | 44.45,97.79 66.67,97.79 69.85,94.61 QG2.8 | IC3.14 44.45,97.79 | IC1.14 17.78,97.79 | IC7.14 17.78,79.38 20.32,81.92 v36.83,81.92 v36.83,82.55 | v11.91,37.47 v11.91,38.1 v11.91,45.24 v11.91,45.88 | R5.2 54.61,29.21 54.61,26.04 46.99,26.04 C1.1 IC9.20 | RN1.1 29.21,29.84 29.84,30.48 v33.02,30.48 | v38.09,77.47 v38.73,77.47 IC5.14 | IC6.20 v44.45,66.64 v44.45,66.65 v44.45,67.28
WR
  Top 0.254: IC5.11 52.12,77.52 54.56,77.52 IC5.10

### Text on the board
tPlace: 99x99 mm | extern | intern | 74HC30 | 74HC04 | /WR high 0xfee6 / /WR low 0xfee7 | SN76489 | 74HC11 | 74HC00 | SN76489 D0..7 0xfee0 | 74HC574 | 0xfee1 | 74HC138 | parallel / output | Minimal 64x4 / Expansion 1 Rev.3 / SN76489 Sound / Kempston Joystick Port / 8 bit parallel output | --------- / 1|VCC D0|2 / |D1 D2| / D3 D4| / |D5 D6| / 9|D7 GND |10 / --------- | 74HC574 | 0xfee2 | 74HC574 | Kempston Joystick